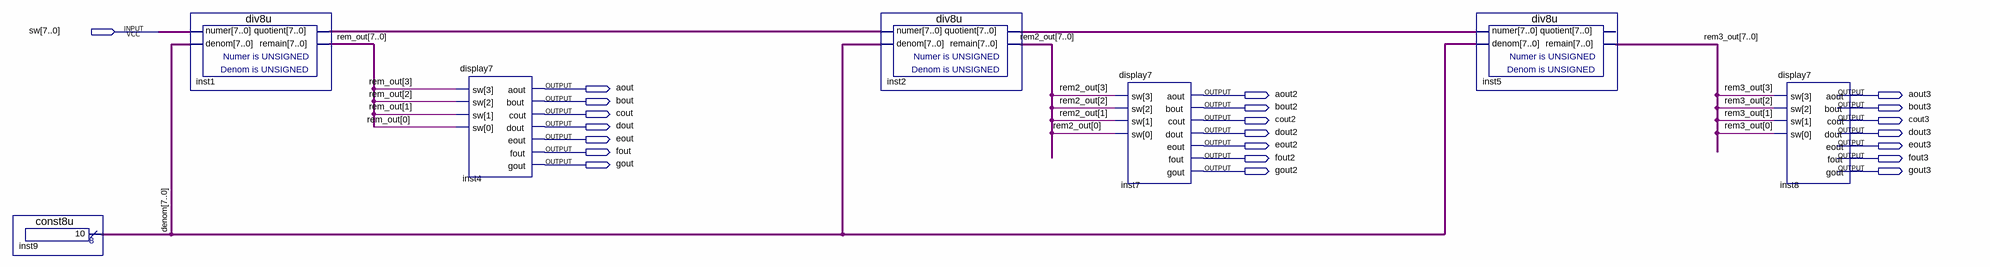
[diagram p0: schematic sheet]
// Quartus schematic display_8bits.bdf as structural Verilog: 7 symbols, 22 pins
module display_8bits (
  input  [7:0] sw,
  output aout,
  output aout2,
  output aout3,
  output bout,
  output bout2,
  output bout3,
  output cout,
  output cout2,
  output cout3,
  output dout,
  output dout2,
  output dout3,
  output eout,
  output eout2,
  output eout3,
  output fout,
  output fout2,
  output fout3,
  output gout,
  output gout2,
  output gout3
);

  wire [7:0] denom, inst1_quotient, inst2_quotient, rem2_out, rem3_out, rem_out;

  const8u inst9 (.result(denom));
  div8u inst1 (.numer(sw), .denom(denom), .quotient(inst1_quotient), .remain(rem_out));
  display7 inst4 (
    .sw(rem_out[3:0]), .aout(aout), .bout(bout), .cout(cout), .dout(dout), .eout(eout), .fout(fout),
    .gout(gout));
  div8u inst2 (.numer(inst1_quotient), .denom(denom), .quotient(inst2_quotient), .remain(rem2_out));
  display7 inst7 (
    .sw(rem2_out[3:0]), .aout(aout2), .bout(bout2), .cout(cout2), .dout(dout2), .eout(eout2), .fout(fout2),
    .gout(gout2));
  div8u inst5 (.numer(inst2_quotient), .denom(denom), .remain(rem3_out));  // open: quotient
  display7 inst8 (
    .sw(rem3_out[3:0]), .aout(aout3), .bout(bout3), .cout(cout3), .dout(dout3), .eout(eout3), .fout(fout3),
    .gout(gout3));
endmodule
